# EAGLE design BRD100504 (EAGLE 5.04)
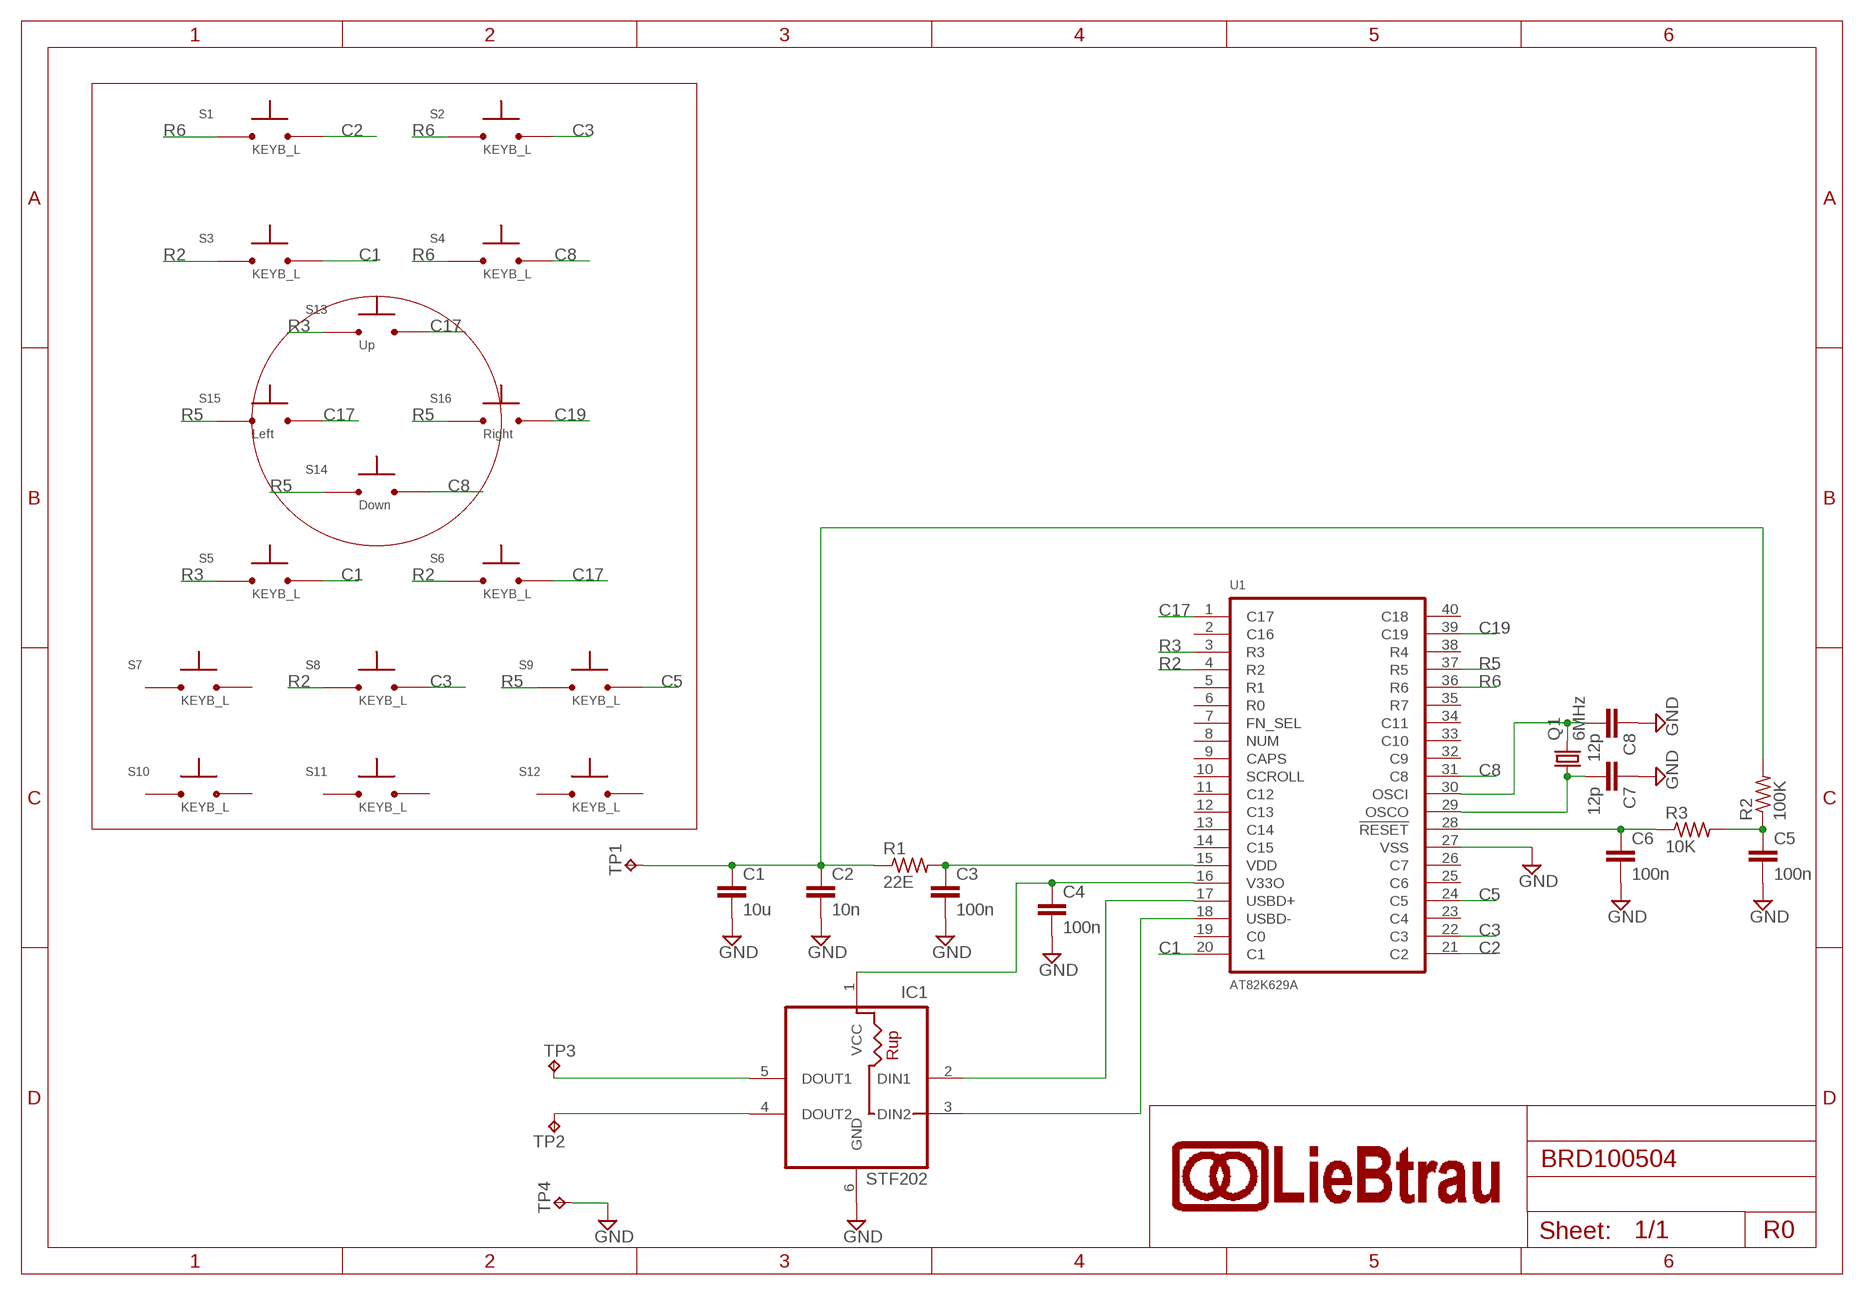
[diagram p0: schematic, sheet 1]

## Parts
C1  10u  C-EUC1206  [C1206]
C2  10n  C-EUC0805  [C0805]
C3  100n  C-EUC0805  [C0805]
C4  100n  C-EUC0805  [C0805]
C5  100n  C-EUC0805  [C0805]
C6  100n  C-EUC0805  [C0805]
C7  12p  C-EUC0603  [C0603]
C8  12p  C-EUC0603  [C0603]
IC1  STF202  [TSOP6]
Q1  6MHz  CRYSTALHC49UP  [HC49UP]
R1  22E  R-US_R0805  [R0805]
R2  100K  R-US_R0805  [R0805]
R3  10K  R-US_R0805  [R0805]
S1  KEYB_L  [KEYB_L]
S2  KEYB_L  [KEYB_L]
S3  KEYB_L  [KEYB_L]
S4  KEYB_L  [KEYB_L]
S5  KEYB_L  [KEYB_L]
S6  KEYB_L  [KEYB_L]
S7  KEYB_L  [KEYB_L]
S8  KEYB_L  [KEYB_L]
S9  KEYB_L  [KEYB_L]
S10  KEYB_L  [KEYB_L]
S11  KEYB_L  [KEYB_L]
S12  KEYB_L  [KEYB_L]
S13  Up  KEYB_S  [KEYB_S]
S14  Down  KEYB_S  [KEYB_S]
S15  Left  KEYB_S  [KEYB_S]
S16  Right  KEYB_S  [KEYB_S]
TP1  TPTP20R  [TP20R]
TP2  TPTP20R  [TP20R]
TP3  TPTP20R  [TP20R]
TP4  TPTP20R  [TP20R]
U1  AT82K629A  [DIP40X]

## Nets
C1: S3.P$2 S5.P$2 U1.20(C1)
C2: S1.P$2 U1.21(C2)
C3: S2.P$2 S8.P$2 U1.22(C3)
C5: S9.P$2 U1.24(C5)
C8: S4.P$2 S14.P$2 U1.31(C8)
C17: S6.P$2 S13.P$2 S15.P$2 U1.1(C17)
C19: S16.P$2 U1.39(C19)
GND: C1.2 C2.2 C3.2 C4.2 C5.2 C6.2 C7.1 C8.1 IC1.6(GND) TP4.TP U1.27(VSS)
N$1: C1.1 C2.1 R1.1 R2.2 TP1.TP
N$2: C4.1 IC1.1(VCC) U1.16(V33O)
N$3: IC1.5(DOUT1) TP3.TP
N$4: IC1.3(DIN2) U1.18(USBD-)
N$5: IC1.4(DOUT2) TP2.TP
N$6: C3.1 R1.2 U1.15(VDD)
N$7: IC1.2(DIN1) U1.17(USBD+)
N$8: C5.1 R2.1 R3.2
N$9: C6.1 R3.1 U1.28(!RESET)
N$10: C7.2 Q1.1 U1.29(OSCO)
N$11: C8.2 Q1.2 U1.30(OSCI)
R2: S3.P$1 S6.P$1 S8.P$1 U1.4(R2)
R3: S5.P$1 S13.P$1 U1.3(R3)
R5: S9.P$1 S14.P$1 S15.P$1 S16.P$1 U1.37(R5)
R6: S1.P$1 S2.P$1 S4.P$1 U1.36(R6)
Unconnected: S7.P$1 S7.P$2 S10.P$1 S10.P$2 S11.P$1 S11.P$2 S12.P$1 S12.P$2 U1.2(C16) U1.5(R1) U1.6(R0) U1.7(FN_SEL) U1.8(NUM) U1.9(CAPS) U1.10(SCROLL) U1.11(C12) U1.12(C13) U1.13(C14) U1.14(C15) U1.19(C0) U1.23(C4) U1.25(C6) U1.26(C7) U1.32(C9) U1.33(C10) U1.34(C11) U1.35(R7) U1.38(R4) U1.40(C18)

## Notes on the sheet
- R0

## Library data of the parts
C1-C8 = rcl:C-EU: CAPACITOR, European symbol
IC1 = Traficon:STF202: USB Filter with ESD Protection
Q1 = crystal:CRYSTAL: CRYSTAL
R1-R3 = rcl:R-US_: RESISTOR, American symbol
S1-S12 = usbkeypad:KEYB_L
S13-S16 = usbkeypad:KEYB_S
TP1-TP4 = testpad:TP: Test pad
U1 = usbkeypad:AT82K629A

## Board
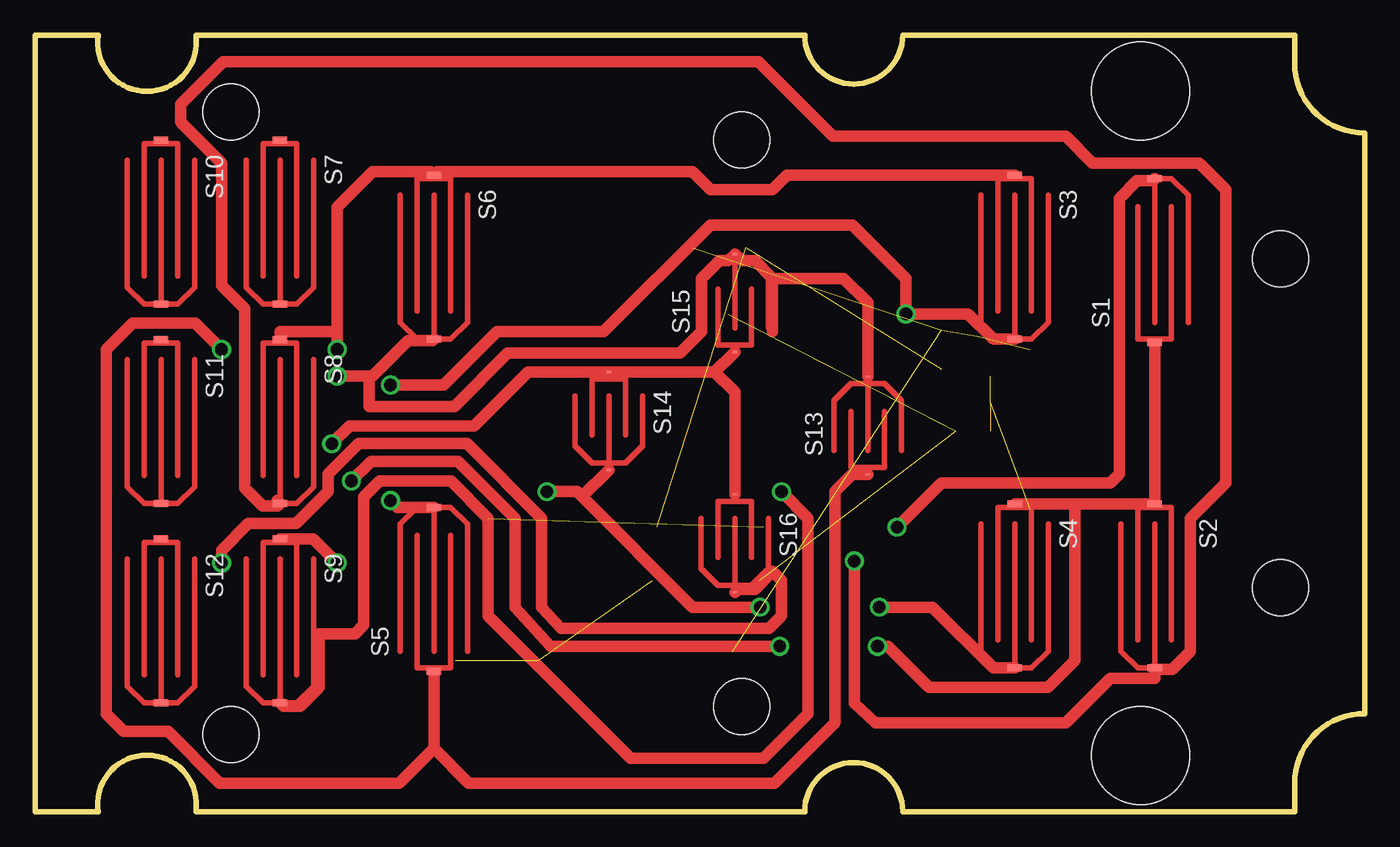
[diagram p1: board, top side]
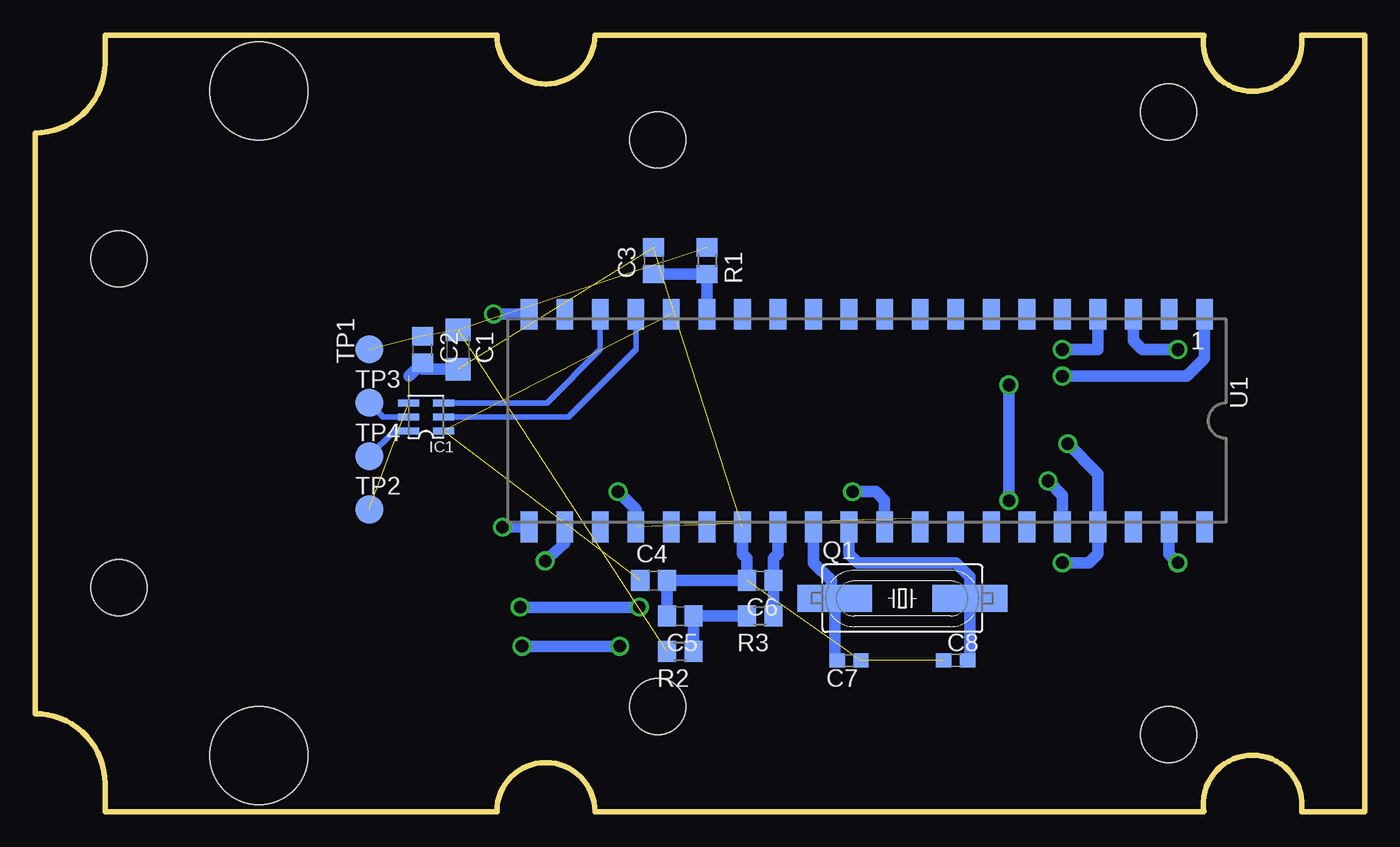
[diagram p2: board, bottom side, seen from below]

Size 95 x 55.5 mm. Coordinates in mm from the lower left corner, seen from the top.
Outline: 95,7 95,48.5 arc-90 90,53.5 90,55.5 62,55.5 arc-180 55,55.5 11.5,55.5 arc-196 4.5,55.5 0,55.5 0,0 4.5,0 arc-196 11.5,0 55,0 arc-180 62,0 90,0 90,2 arc-90 95,7
Copper layers (1*16): Top 0.035mm / dielectric 1.5mm / Bottom 0.035mm
Design rules "default": minimum track width 10mil, minimum drill 24mil, track to track 8mil, track to pad 8mil, pad to pad 8mil, via to via 8mil, smd to smd 8mil, copper to edge 40mil, drill to drill 8mil, minimum pad ring 10mil, minimum via ring 8mil, stop-mask expansion 4mil, vias tented up to drill 0mil, thermal gap 10mil
Holes 4 mm at 89,39.5 89,16 50.5,48 50.5,7.5 14,5.5 14,50
Holes 7 mm at 79,51.5 79,4

### Footprints (pad centres in the part's own frame; a part is rotated, then mirrored left to right if it is on the bottom)
C1206 = smd 1.6 x 1.8: 1 -1.4,0; 2 1.4,0
C0805 = smd 1.3 x 1.5: 1 -0.95,0; 2 0.95,0
C0603 = smd 1.1 x 1: 1 -0.85,0; 2 0.85,0
TSOP6 = smd 0.5 x 1.5: 1 -2,-1.5; 2 -1,-1.5; 3 0,-1.5; 4 0,1; 5 -1,1; 6 -2,1
HC49UP = smd 5.334 x 1.93: 1 -4.826,0; 2 4.826,0
R0805 = smd 1.3 x 1.5: 1 -0.95,0; 2 0.95,0
KEYB_L = smd 0.508 x 1.016: P$1 -5.992,0; P$2 5.738,0
KEYB_S = smd 0.152 x 0.305: P$1 -3.66,0; P$2 3.34,0
TP20R = smd 2 x 2: TP 0,0
DIP40X = smd 1.2 x 2.2: 1 -24.13,-7.6; 2 -21.59,-7.6; 3 -19.05,-7.6; 4 -16.51,-7.6; 5 -13.97,-7.6; 6 -11.43,-7.6; 7 -8.89,-7.6; 8 -6.35,-7.6; 9 -3.81,-7.6; 10 -1.27,-7.6; 11 1.27,-7.6; 12 3.81,-7.6; 13 6.35,-7.6; 14 8.89,-7.6; 15 11.43,-7.6; 16 13.97,-7.6; 17 16.51,-7.6; 18 19.05,-7.6; 19 21.59,-7.6; 20 24.13,-7.6; 21 24.13,7.6; 22 21.59,7.6; 23 19.05,7.6; 24 16.51,7.6; 25 13.97,7.6; 26 11.43,7.6; 27 8.89,7.6; 28 6.35,7.6; 29 3.81,7.6; 30 1.27,7.6; 31 -1.27,7.6; 32 -3.81,7.6; 33 -6.35,7.6; 34 -8.89,7.6; 35 -11.43,7.6; 36 -13.97,7.6; 37 -16.51,7.6; 38 -19.05,7.6; 39 -21.59,7.6; 40 -24.13,7.6

### Placement (x,y rotation side)
C1  64.77,33.02 270 bottom
C2  67.31,33.02 270 bottom
C3  50.8,39.37 90 bottom
C4  50.8,16.51 0 bottom
C5  48.9,13.97 180 bottom
C6  43.18,16.51 180 bottom
C7  36.83,10.79 180 bottom
C8  29.21,10.79 0 bottom
IC1  67.31,29.21 90 bottom
Q1  33.02,15.24 0 bottom
R1  46.99,39.37 270 bottom
R2  48.9,11.43 180 bottom
R3  43.18,13.97 180 bottom
S1  80,39.5 90 top
S2  80,16 270 top
S3  70,39.5 270 top
S4  70,16 270 top
S5  28.5,16 90 top
S6  28.5,39.5 270 top
S7  17.5,42 270 top
S8  17.5,27.75 270 top
S9  17.5,13.5 270 top
S10  9,42 270 top
S11  9,27.75 270 top
S12  9,13.5 270 top
S13  59.5,27.75 90 top
S14  41,27.75 270 top
S15  50,36.5 90 top
S16  50,19 270 top
TP1  71.12,33.02 90 bottom
TP2  71.12,21.59 0 bottom
TP3  71.12,29.21 0 bottom
TP4  71.12,25.4 0 bottom
U1  35.56,27.94 180 bottom

### Tracks (layer width: path | path; a pad name or v marks a point on that pad's centre or on a via)
C1  (via drill 0.9)
  Top 0.813: S3.P$2 68.47,33.76 66.67,35.56 v62.23,35.56 62.23,38.1 58.42,41.91 48.26,41.91 40.64,34.29 33.02,34.29 29.21,30.48 v25.4,30.48 | S5.P$2 25.89,21.74 v25.4,22.23
  Bottom 0.813: U1.20 62.21,35.54 v62.23,35.56 | v25.4,22.23 v25.4,30.48
C2  (via drill 0.9)
  Top 0.813: S1.P$2 79.85,45.09 78.74,45.09 77.47,43.81 77.47,24.13 76.83,23.5 64.77,23.5 v61.59,20.32
  Bottom 0.813: U1.21 61.58,20.34 v61.59,20.32
C3  (via drill 0.9)
  Top 0.813: 17.29,22.23 S8.P$2 17.33,21.84 16.26,21.84 14.99,23.11 14.99,35.94 13.34,37.59 13.34,46.35 10.41,49.28 10.41,50.55 13.46,53.59 51.69,53.59 57.02,48.26 73.66,48.26 75.56,46.35 83.19,46.35 85.09,44.45 85.09,23.5 82.55,20.95 82.55,11.43 81.28,10.16 80.1,10.16 S2.P$2 80.01,9.53 76.83,9.53 73.66,6.35 60.07,6.35 58.55,7.75 v58.55,17.91
  Bottom 0.813: U1.22 57.15,19.18 v58.55,17.91
C5  (via drill 0.9)  (1 unrouted)
  Top 0.813: S9.P$2 17.75,7.51 18.94,7.51 20.32,8.89 20.32,12.7 22.86,12.7 23.5,13.34 23.5,22.48 24.64,23.62 29.72,23.62 32.38,20.95 32.38,13.97 42.55,3.81 52.07,3.81 55.24,6.99 55.24,20.95 v53.34,22.86
  Bottom 0.813: U1.24 52.07,21.59 v53.34,22.86
C8  (via drill 0.9)
  Top 0.813: v51.82,14.61 46.99,14.61 39.05,22.54 | v60.33,14.61 64.14,14.61 68.48,10.26 S4.P$2 | 39.05,22.54 38.73,22.86 v36.58,22.86 | S14.P$2 39.13,22.54 39.05,22.54
  Bottom 0.813: v51.82,14.61 v60.33,14.61 | U1.31 34.29,22.23 34.92,22.86 v36.58,22.86
C17  (via drill 0.9)
  Top 0.813: v21.59,31.11 23.88,31.11 | 52.7,38.1 52.7,34.29 | 52.7,38.1 51.44,39.37 50.47,39.37 S15.P$2 49.53,39.37 48.9,39.37 47.62,38.1 47.62,34.29 46.1,32.77 33.78,32.77 29.97,28.96 23.88,28.96 23.88,31.11 | S13.P$2 59.5,36.38 57.78,38.1 52.7,38.1 | 23.88,31.11 24.13,31.11 26.67,33.66 28.39,33.66 S6.P$2
  Bottom 0.813: U1.1 11.43,32.38 12.7,31.11 v21.59,31.11
C19  (via drill 0.9)
  Top 0.813: v13.34,17.78 13.34,18.67 15.24,20.57 18.67,20.57 20.95,22.86 20.95,24.13 23.11,26.29 30.86,26.29 36.2,20.95 36.2,14.61 37.59,13.08 52.45,13.08 53.34,13.97 53.34,16.51 52.7,17.14 51.44,15.88 50.22,15.88 S16.P$2
  Bottom 0.813: U1.39 13.97,18.41 v13.34,17.78
GND  (5 unrouted)
  Bottom 0.406: IC1.6 69.31,27.21 TP4.TP
  Bottom 0.813: C1.2 67.31,31.62 C2.2 68.27,31.11 | U1.27 44.45,18.41 44.13,18.09 C6.2 C4.2 C5.2
N$1  (4 unrouted)
N$2  (2 unrouted)
N$3
  Bottom 0.406: IC1.5 70.12,28.21 TP3.TP
N$4
  Bottom 0.406: IC1.3 58.42,29.21 54.61,33.02 U1.18
N$5  (1 unrouted)
N$6
  Bottom 0.813: U1.15 R1.2 C3.1
N$7
  Bottom 0.406: IC1.2 56.88,28.21 52.07,33.02 U1.17
N$8
  Bottom 0.813: R3.2 C5.1 R2.1
N$9
  Bottom 0.813: U1.28 41.91,18.41 42.23,18.09 C6.1 R3.1
N$10
  Bottom 0.813: U1.29 39.37,17.78 38.1,16.51 38.1,15.49 Q1.1 37.85,10.96 C7.2
N$11
  Bottom 0.813: U1.30 36.83,18.41 36.2,17.78 29.21,17.78 28.19,16.76 Q1.2 28.19,10.96 C8.2
R2  (via drill 0.9)
  Top 0.813: S8.P$1 17.5,34.29 21.59,34.29 | 21.59,34.29 v21.59,33.02 21.59,33 | 21.59,34.29 21.59,43.18 24.13,45.72 28.27,45.72 S6.P$1 28.73,45.72 46.99,45.72 48.26,44.45 52.7,44.45 53.75,45.49 S3.P$1
  Bottom 0.813: U1.4 19.05,33.02 v21.59,33.02
R3  (via drill 0.9)
  Top 0.813: 28.5,4.52 30.99,2.03 52.83,2.03 57.15,6.35 57.15,22.86 58.38,24.09 S13.P$1 | 28.5,4.52 S5.P$1 | 28.5,4.52 26.01,2.03 13.21,2.03 9.53,5.71 6.35,5.71 5.08,6.99 5.08,33.02 6.99,34.92 11.43,34.92 v13.34,33.02
  Bottom 0.813: U1.3 16.51,33.66 15.88,33.02 v13.34,33.02
R5  (via drill 0.9)
  Top 0.813: 48.57,31.41 S14.P$1 35.22,31.41 31.37,27.56 22.48,27.56 v21.21,26.29 | 48.57,31.41 S15.P$1 | S16.P$1 50,29.98 48.57,31.41 | S9.P$1 19.88,19.49 v21.59,17.78
  Bottom 0.813: v21.59,17.78 19.68,17.78 19.05,18.41 U1.37 19.05,24.13 v21.21,26.29
R6  (via drill 0.9)
  Top 0.813: S1.P$1 S2.P$1 74.3,21.99 | 74.3,21.99 S4.P$1 | v53.21,11.81 36.83,11.81 34.29,14.61 34.29,20.95 30.23,25.02 24,25.02 v22.61,23.62 | v60.2,11.81 60.96,11.81 63.88,8.89 72.39,8.89 74.3,10.79 74.3,21.99
  Bottom 0.813: U1.36 21.59,22.61 v22.61,23.62 | v53.21,11.81 v60.2,11.81